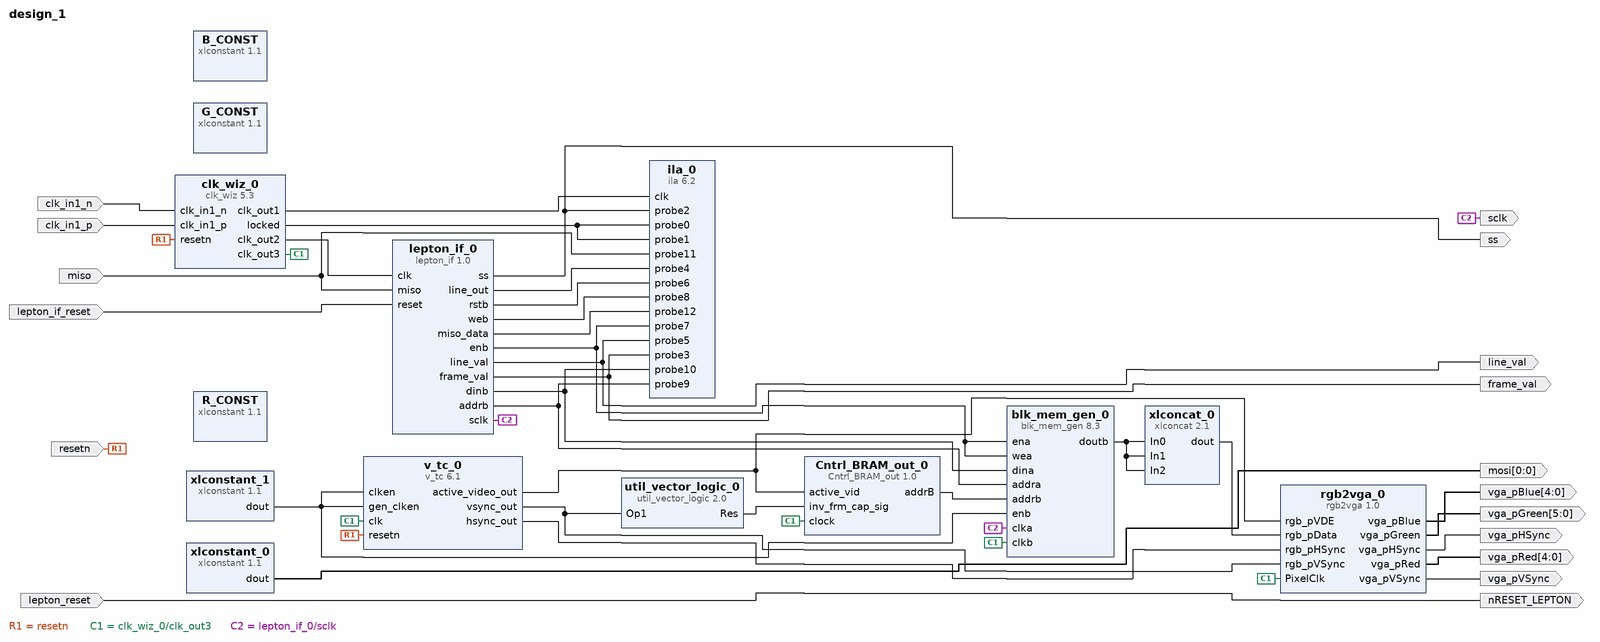
[diagram p0: block diagram of the top level]
# Vivado block design design_1, xc7k325tffg900-2, Vivado 2016.4
create_bd_design design_1

create_bd_port -dir I -type clk clk_in1_n
create_bd_port -dir I -type clk clk_in1_p
create_bd_port -dir I -type rst resetn
create_bd_port -dir O -type rst nRESET_LEPTON
create_bd_port -dir O ss
create_bd_port -dir I miso
create_bd_port -dir O -from 0 -to 0 mosi
create_bd_port -dir O line_val
create_bd_port -dir O frame_val
create_bd_port -dir O -from 4 -to 0 vga_pBlue
create_bd_port -dir O -from 4 -to 0 vga_pRed
create_bd_port -dir O -from 5 -to 0 vga_pGreen
create_bd_port -dir O vga_pHSync
create_bd_port -dir O vga_pVSync
create_bd_port -dir O sclk
create_bd_port -dir I -type rst lepton_reset
create_bd_port -dir I -type rst lepton_if_reset

create_bd_cell -type ip -vlnv xilinx.com:ip:clk_wiz:5.3 clk_wiz_0
set_property -dict [list \
  CONFIG.CLKIN1_JITTER_PS 50.0 \
  CONFIG.CLKOUT2_USED true \
  CONFIG.CLKOUT3_USED true \
  CONFIG.NUM_OUT_CLKS 3 \
  CONFIG.CLKOUT2_REQUESTED_OUT_FREQ 5 \
  CONFIG.CLKOUT3_REQUESTED_OUT_FREQ 25.175 \
  CONFIG.PRIM_SOURCE Differential_clock_capable_pin \
  CONFIG.RESET_PORT resetn \
  CONFIG.MMCM_DIVCLK_DIVIDE 1 \
  CONFIG.MMCM_CLKFBOUT_MULT_F 3.125 \
  CONFIG.MMCM_CLKIN1_PERIOD 5.0 \
  CONFIG.MMCM_CLKOUT0_DIVIDE_F 6.250 \
  CONFIG.MMCM_CLKOUT1_DIVIDE 125 \
  CONFIG.MMCM_CLKOUT2_DIVIDE 25 \
  CONFIG.RESET_TYPE ACTIVE_LOW \
  CONFIG.CLK_IN1_BOARD_INTERFACE sys_diff_clock \
  CONFIG.RESET_BOARD_INTERFACE reset \
  CONFIG.CLKOUT1_JITTER 107.586 \
  CONFIG.CLKOUT1_PHASE_ERROR 103.084 \
  CONFIG.CLKOUT2_JITTER 196.698 \
  CONFIG.CLKOUT2_PHASE_ERROR 103.084 \
  CONFIG.CLKOUT3_JITTER 142.693 \
  CONFIG.CLKOUT3_PHASE_ERROR 103.084 \
] [get_bd_cells clk_wiz_0]
create_bd_cell -type ip -vlnv xilinx.com:ip:ila:6.2 ila_0
set_property -dict [list \
  CONFIG.C_PROBE12_WIDTH 16 \
  CONFIG.C_PROBE10_WIDTH 8 \
  CONFIG.C_PROBE9_WIDTH 19 \
  CONFIG.C_PROBE8_WIDTH 4 \
  CONFIG.C_PROBE7_WIDTH 1 \
  CONFIG.C_PROBE6_WIDTH 1 \
  CONFIG.C_PROBE4_WIDTH 8 \
  CONFIG.C_DATA_DEPTH 131072 \
  CONFIG.C_NUM_OF_PROBES 13 \
  CONFIG.C_ENABLE_ILA_AXI_MON false \
  CONFIG.C_MONITOR_TYPE Native \
] [get_bd_cells ila_0]
create_bd_cell -type ip -vlnv xilinx.com:ip:xlconstant:1.1 xlconstant_0
set_property -dict {CONFIG.CONST_VAL 0} [get_bd_cells xlconstant_0]
create_bd_cell -type ip -vlnv digilentinc.com:ip:rgb2vga:1.0 rgb2vga_0
create_bd_cell -type ip -vlnv xilinx.com:ip:v_tc:6.1 v_tc_0
set_property -dict [list \
  CONFIG.HAS_AXI4_LITE false \
  CONFIG.max_clocks_per_line 1024 \
  CONFIG.max_lines_per_frame 1024 \
  CONFIG.VIDEO_MODE 640x480p \
  CONFIG.enable_detection false \
  CONFIG.vertical_blank_generation false \
  CONFIG.horizontal_blank_generation false \
] [get_bd_cells v_tc_0]
create_bd_cell -type ip -vlnv xilinx.com:ip:xlconstant:1.1 G_CONST
set_property -dict {CONFIG.CONST_WIDTH 8 CONFIG.CONST_VAL 255} [get_bd_cells G_CONST]
create_bd_cell -type ip -vlnv xilinx.com:ip:xlconstant:1.1 B_CONST
set_property -dict {CONFIG.CONST_WIDTH 8 CONFIG.CONST_VAL 0} [get_bd_cells B_CONST]
create_bd_cell -type ip -vlnv xilinx.com:ip:xlconcat:2.1 xlconcat_0
set_property -dict {CONFIG.NUM_PORTS 3} [get_bd_cells xlconcat_0]
create_bd_cell -type ip -vlnv xilinx.com:ip:xlconstant:1.1 xlconstant_1
set_property -dict {CONFIG.CONST_VAL 1} [get_bd_cells xlconstant_1]
create_bd_cell -type ip -vlnv xilinx.com:ip:xlconstant:1.1 R_CONST
set_property -dict {CONFIG.CONST_WIDTH 8 CONFIG.CONST_VAL 0} [get_bd_cells R_CONST]
create_bd_cell -type ip -vlnv xilinx.com:user:lepton_if:1.0 lepton_if_0
create_bd_cell -type ip -vlnv xilinx.com:ip:blk_mem_gen:8.3 blk_mem_gen_0
set_property -dict [list \
  CONFIG.Memory_Type Simple_Dual_Port_RAM \
  CONFIG.Enable_32bit_Address false \
  CONFIG.Use_Byte_Write_Enable false \
  CONFIG.Write_Width_A 8 \
  CONFIG.Operating_Mode_A NO_CHANGE \
  CONFIG.Write_Width_B 8 \
  CONFIG.Read_Width_B 8 \
  CONFIG.Enable_B Use_ENB_Pin \
  CONFIG.Register_PortB_Output_of_Memory_Primitives true \
  CONFIG.Fill_Remaining_Memory_Locations true \
  CONFIG.Port_B_Clock 100 \
  CONFIG.Port_B_Enable_Rate 100 \
  CONFIG.use_bram_block Stand_Alone \
] [get_bd_cells blk_mem_gen_0]
create_bd_cell -type ip -vlnv xilinx.com:user:Cntrl_BRAM_out:1.0 Cntrl_BRAM_out_0
create_bd_cell -type ip -vlnv xilinx.com:ip:util_vector_logic:2.0 util_vector_logic_0
set_property -dict {CONFIG.C_SIZE 1 CONFIG.C_OPERATION not} [get_bd_cells util_vector_logic_0]

# ---- connections ----

connect_bd_net [get_bd_ports clk_in1_n] [get_bd_pins clk_wiz_0/clk_in1_n]
connect_bd_net [get_bd_ports clk_in1_p] [get_bd_pins clk_wiz_0/clk_in1_p]
connect_bd_net [get_bd_ports resetn] [get_bd_pins clk_wiz_0/resetn] [get_bd_pins v_tc_0/resetn]
connect_bd_net [get_bd_pins clk_wiz_0/clk_out1] [get_bd_pins ila_0/clk]
connect_bd_net [get_bd_pins clk_wiz_0/locked] [get_bd_pins ila_0/probe0] [get_bd_pins ila_0/probe1]
connect_bd_net [get_bd_pins lepton_if_0/ss] [get_bd_ports ss] [get_bd_pins ila_0/probe2]
connect_bd_net [get_bd_pins lepton_if_0/line_out] [get_bd_pins ila_0/probe4]
connect_bd_net [get_bd_ports miso] [get_bd_pins ila_0/probe11] [get_bd_pins lepton_if_0/miso]
connect_bd_net [get_bd_pins xlconstant_0/dout] [get_bd_ports mosi]
connect_bd_net [get_bd_pins lepton_if_0/rstb] [get_bd_pins ila_0/probe6]
connect_bd_net [get_bd_pins lepton_if_0/enb] [get_bd_pins ila_0/probe7] [get_bd_pins blk_mem_gen_0/ena] [get_bd_pins blk_mem_gen_0/wea]
connect_bd_net [get_bd_pins lepton_if_0/web] [get_bd_pins ila_0/probe8]
connect_bd_net [get_bd_pins lepton_if_0/miso_data] [get_bd_pins ila_0/probe12]
connect_bd_net [get_bd_pins lepton_if_0/line_val] [get_bd_ports line_val] [get_bd_pins ila_0/probe5]
connect_bd_net [get_bd_pins lepton_if_0/frame_val] [get_bd_ports frame_val] [get_bd_pins ila_0/probe3]
connect_bd_net [get_bd_pins rgb2vga_0/vga_pBlue] [get_bd_ports vga_pBlue]
connect_bd_net [get_bd_pins rgb2vga_0/vga_pRed] [get_bd_ports vga_pRed]
connect_bd_net [get_bd_pins rgb2vga_0/vga_pGreen] [get_bd_ports vga_pGreen]
connect_bd_net [get_bd_pins rgb2vga_0/vga_pHSync] [get_bd_ports vga_pHSync]
connect_bd_net [get_bd_pins rgb2vga_0/vga_pVSync] [get_bd_ports vga_pVSync]
connect_bd_net [get_bd_pins v_tc_0/active_video_out] [get_bd_pins rgb2vga_0/rgb_pVDE] [get_bd_pins Cntrl_BRAM_out_0/active_vid]
connect_bd_net [get_bd_pins v_tc_0/hsync_out] [get_bd_pins rgb2vga_0/rgb_pHSync]
connect_bd_net [get_bd_pins v_tc_0/vsync_out] [get_bd_pins rgb2vga_0/rgb_pVSync] [get_bd_pins util_vector_logic_0/Op1]
connect_bd_net [get_bd_pins clk_wiz_0/clk_out3] \
  [get_bd_pins rgb2vga_0/PixelClk] [get_bd_pins v_tc_0/clk] [get_bd_pins blk_mem_gen_0/clkb] \
  [get_bd_pins Cntrl_BRAM_out_0/clock]
connect_bd_net [get_bd_pins xlconcat_0/dout] [get_bd_pins rgb2vga_0/rgb_pData]
connect_bd_net [get_bd_pins xlconstant_1/dout] [get_bd_pins v_tc_0/clken] [get_bd_pins v_tc_0/gen_clken] [get_bd_pins blk_mem_gen_0/enb]
connect_bd_net [get_bd_pins lepton_if_0/sclk] [get_bd_ports sclk] [get_bd_pins blk_mem_gen_0/clka]
connect_bd_net [get_bd_pins lepton_if_0/dinb] [get_bd_pins ila_0/probe10] [get_bd_pins blk_mem_gen_0/dina]
connect_bd_net [get_bd_pins clk_wiz_0/clk_out2] [get_bd_pins lepton_if_0/clk]
connect_bd_net [get_bd_pins lepton_if_0/addrb] [get_bd_pins ila_0/probe9] [get_bd_pins blk_mem_gen_0/addra]
connect_bd_net [get_bd_ports lepton_reset] [get_bd_ports nRESET_LEPTON]
connect_bd_net -net reset_1 [get_bd_ports lepton_if_reset] [get_bd_pins lepton_if_0/reset]
connect_bd_net [get_bd_pins Cntrl_BRAM_out_0/addrB] [get_bd_pins blk_mem_gen_0/addrb]
connect_bd_net [get_bd_pins util_vector_logic_0/Res] [get_bd_pins Cntrl_BRAM_out_0/inv_frm_cap_sig]
connect_bd_net [get_bd_pins blk_mem_gen_0/doutb] [get_bd_pins xlconcat_0/In0] [get_bd_pins xlconcat_0/In2] [get_bd_pins xlconcat_0/In1]

validate_bd_design
save_bd_design
